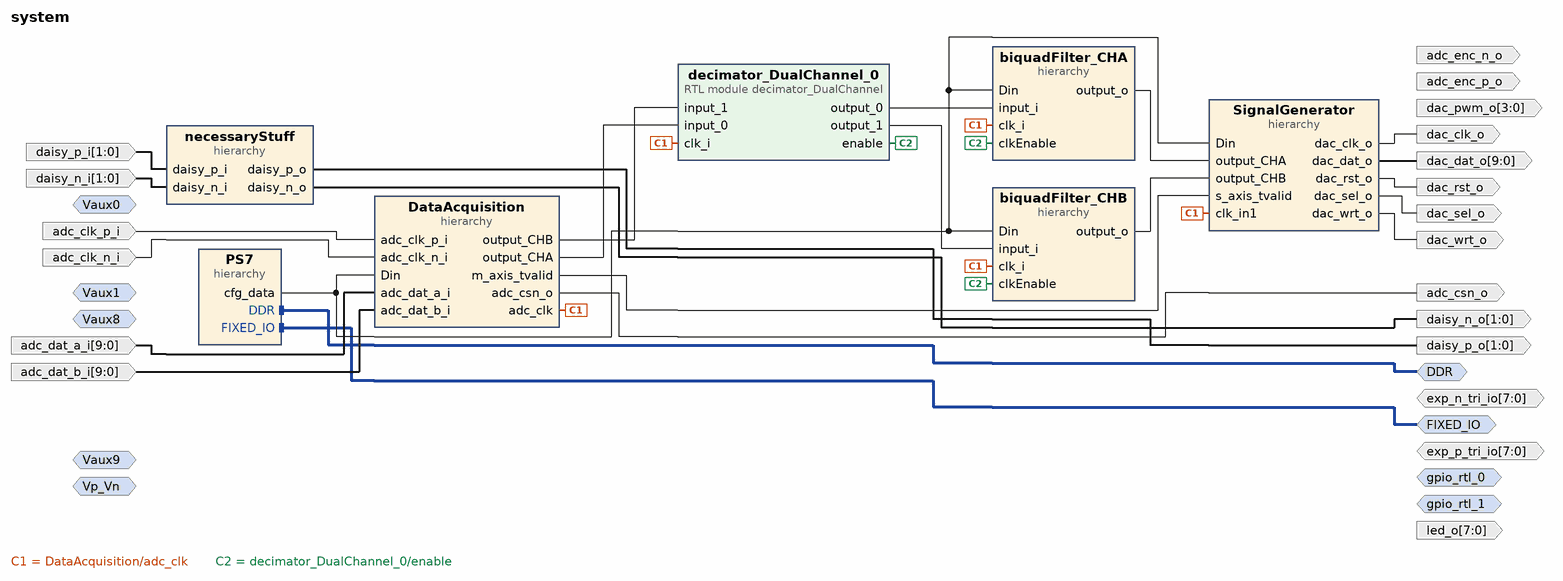
[diagram p0: block diagram of the top level]
# Vivado block design system, xc7z010clg400-1, Vivado 2020.1
create_bd_design system

create_bd_intf_port -mode Slave -vlnv xilinx.com:interface:diff_analog_io_rtl:1.0 Vp_Vn
create_bd_intf_port -mode Slave -vlnv xilinx.com:interface:diff_analog_io_rtl:1.0 Vaux0
create_bd_intf_port -mode Slave -vlnv xilinx.com:interface:diff_analog_io_rtl:1.0 Vaux1
create_bd_intf_port -mode Slave -vlnv xilinx.com:interface:diff_analog_io_rtl:1.0 Vaux9
create_bd_intf_port -mode Slave -vlnv xilinx.com:interface:diff_analog_io_rtl:1.0 Vaux8
create_bd_intf_port -mode Master -vlnv xilinx.com:interface:ddrx_rtl:1.0 DDR
create_bd_intf_port -mode Master -vlnv xilinx.com:display_processing_system7:fixedio_rtl:1.0 FIXED_IO
create_bd_intf_port -mode Master -vlnv xilinx.com:interface:gpio_rtl:1.0 gpio_rtl_0
create_bd_intf_port -mode Master -vlnv xilinx.com:interface:gpio_rtl:1.0 gpio_rtl_1
create_bd_port -dir I -from 9 -to 0 adc_dat_a_i
create_bd_port -dir I -from 9 -to 0 adc_dat_b_i
create_bd_port -dir I adc_clk_p_i
create_bd_port -dir I adc_clk_n_i
create_bd_port -dir O adc_enc_p_o
create_bd_port -dir O adc_enc_n_o
create_bd_port -dir O adc_csn_o
create_bd_port -dir O -from 9 -to 0 dac_dat_o
create_bd_port -dir O dac_clk_o
create_bd_port -dir O dac_rst_o
create_bd_port -dir O dac_sel_o
create_bd_port -dir O dac_wrt_o
create_bd_port -dir O -from 3 -to 0 dac_pwm_o
create_bd_port -dir IO -from 7 -to 0 exp_p_tri_io
create_bd_port -dir IO -from 7 -to 0 exp_n_tri_io
create_bd_port -dir O -from 1 -to 0 daisy_p_o
create_bd_port -dir O -from 1 -to 0 daisy_n_o
create_bd_port -dir I -from 1 -to 0 daisy_p_i
create_bd_port -dir I -from 1 -to 0 daisy_n_i
create_bd_port -dir O -from 7 -to 0 led_o

create_bd_cell -type hier SignalGenerator
create_bd_cell -type hier DataAcquisition
create_bd_cell -type hier PS7
create_bd_cell -type hier biquadFilter_CHA
create_bd_cell -type hier necessaryStuff
create_bd_cell -type module -reference decimator_DualChannel decimator_DualChannel_0
set_property -dict {CONFIG.clock_size 3 CONFIG.input_size 10 CONFIG.output_size 10} [get_bd_cells decimator_DualChannel_0]
create_bd_cell -type hier biquadFilter_CHB

# ---- hierarchy /SignalGenerator ----
current_bd_instance /SignalGenerator
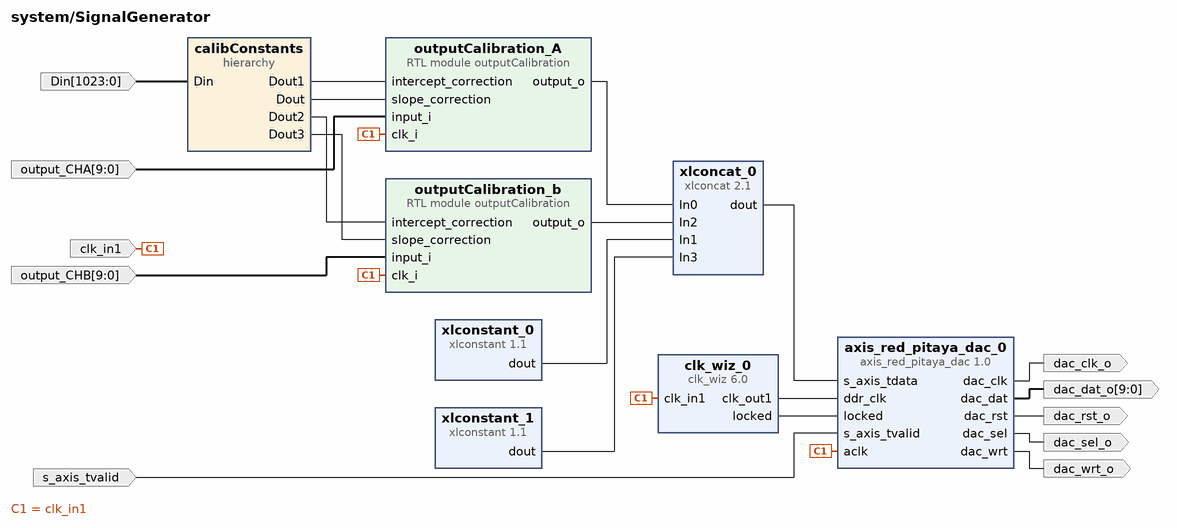
[diagram p1: block diagram inside /SignalGenerator]
create_bd_pin -dir I -type clk clk_in1
create_bd_pin -dir O -type clk dac_clk_o
create_bd_pin -dir O -type rst dac_rst_o
create_bd_pin -dir O dac_sel_o
create_bd_pin -dir O dac_wrt_o
create_bd_pin -dir O -from 9 -to 0 dac_dat_o
create_bd_pin -dir I s_axis_tvalid
create_bd_pin -dir I -from 9 -to 0 output_CHB
create_bd_pin -dir I -from 9 -to 0 output_CHA
create_bd_pin -dir I -from 1023 -to 0 Din

create_bd_cell -type ip -vlnv pavel-demin:user:axis_red_pitaya_dac:1.0 axis_red_pitaya_dac_0
set_property -dict {CONFIG.DAC_DATA_WIDTH 10} [get_bd_cells axis_red_pitaya_dac_0]
create_bd_cell -type ip -vlnv xilinx.com:ip:clk_wiz:6.0 clk_wiz_0
set_property -dict [list \
  CONFIG.CLKIN1_JITTER_PS 80.0 \
  CONFIG.CLKOUT1_JITTER 104.759 \
  CONFIG.CLKOUT1_PHASE_ERROR 96.948 \
  CONFIG.CLKOUT1_REQUESTED_OUT_FREQ 250.000 \
  CONFIG.MMCM_CLKFBOUT_MULT_F 8.000 \
  CONFIG.MMCM_CLKIN1_PERIOD 8.000 \
  CONFIG.MMCM_CLKOUT0_DIVIDE_F 4.000 \
  CONFIG.MMCM_DIVCLK_DIVIDE 1 \
  CONFIG.PRIM_IN_FREQ 125.000 \
  CONFIG.USE_RESET false \
] [get_bd_cells clk_wiz_0]
create_bd_cell -type ip -vlnv xilinx.com:ip:xlconstant:1.1 xlconstant_0
set_property -dict {CONFIG.CONST_VAL 0 CONFIG.CONST_WIDTH 6} [get_bd_cells xlconstant_0]
create_bd_cell -type ip -vlnv xilinx.com:ip:xlconcat:2.1 xlconcat_0
set_property -dict [list \
  CONFIG.IN0_WIDTH 10 \
  CONFIG.IN1_WIDTH 6 \
  CONFIG.IN2_WIDTH 10 \
  CONFIG.IN3_WIDTH 6 \
  CONFIG.NUM_PORTS 4 \
] [get_bd_cells xlconcat_0]
create_bd_cell -type ip -vlnv xilinx.com:ip:xlconstant:1.1 xlconstant_1
set_property -dict {CONFIG.CONST_VAL 0 CONFIG.CONST_WIDTH 6} [get_bd_cells xlconstant_1]
create_bd_cell -type hier calibConstants
create_bd_cell -type module -reference outputCalibration outputCalibration_A
create_bd_cell -type module -reference outputCalibration outputCalibration_b

# ---- hierarchy /SignalGenerator/calibConstants ----
current_bd_instance /SignalGenerator/calibConstants
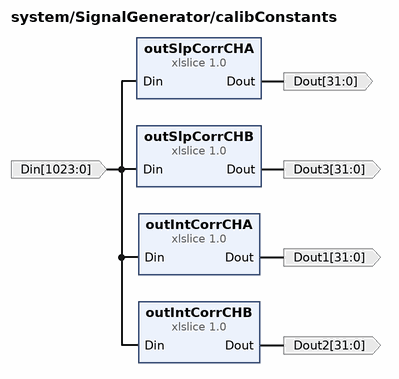
[diagram p2: block diagram inside /SignalGenerator/calibConstants]
create_bd_pin -dir I -from 1023 -to 0 Din
create_bd_pin -dir O -from 31 -to 0 Dout
create_bd_pin -dir O -from 31 -to 0 Dout1
create_bd_pin -dir O -from 31 -to 0 Dout2
create_bd_pin -dir O -from 31 -to 0 Dout3

create_bd_cell -type ip -vlnv xilinx.com:ip:xlslice:1.0 outSlpCorrCHA
set_property -dict {CONFIG.DIN_FROM 543 CONFIG.DIN_TO 512 CONFIG.DIN_WIDTH 1024 CONFIG.DOUT_WIDTH 32} [get_bd_cells outSlpCorrCHA]
create_bd_cell -type ip -vlnv xilinx.com:ip:xlslice:1.0 outIntCorrCHA
set_property -dict {CONFIG.DIN_FROM 511 CONFIG.DIN_TO 480 CONFIG.DIN_WIDTH 1024 CONFIG.DOUT_WIDTH 32} [get_bd_cells outIntCorrCHA]
create_bd_cell -type ip -vlnv xilinx.com:ip:xlslice:1.0 outIntCorrCHB
set_property -dict {CONFIG.DIN_FROM 575 CONFIG.DIN_TO 544 CONFIG.DIN_WIDTH 1024 CONFIG.DOUT_WIDTH 32} [get_bd_cells outIntCorrCHB]
create_bd_cell -type ip -vlnv xilinx.com:ip:xlslice:1.0 outSlpCorrCHB
set_property -dict {CONFIG.DIN_FROM 607 CONFIG.DIN_TO 576 CONFIG.DIN_WIDTH 1024 CONFIG.DOUT_WIDTH 32} [get_bd_cells outSlpCorrCHB]

# ---- hierarchy /DataAcquisition ----
current_bd_instance /DataAcquisition
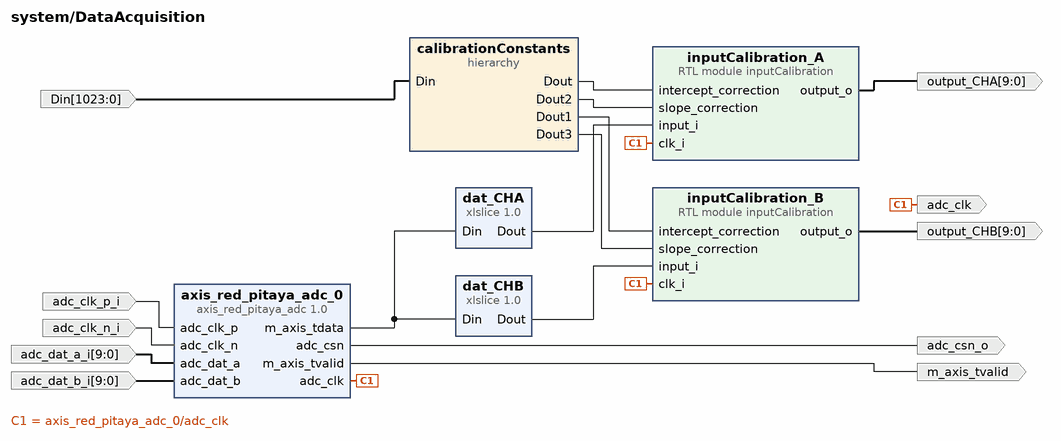
[diagram p3: block diagram inside /DataAcquisition]
create_bd_pin -dir O -type clk adc_clk
create_bd_pin -dir O adc_csn_o
create_bd_pin -dir I adc_clk_p_i
create_bd_pin -dir I adc_clk_n_i
create_bd_pin -dir I -from 9 -to 0 adc_dat_a_i
create_bd_pin -dir I -from 9 -to 0 adc_dat_b_i
create_bd_pin -dir O m_axis_tvalid
create_bd_pin -dir O -from 9 -to 0 output_CHA
create_bd_pin -dir O -from 9 -to 0 output_CHB
create_bd_pin -dir I -from 1023 -to 0 Din

create_bd_cell -type ip -vlnv pavel-demin:user:axis_red_pitaya_adc:1.0 axis_red_pitaya_adc_0
set_property -dict {CONFIG.ADC_DATA_WIDTH 10} [get_bd_cells axis_red_pitaya_adc_0]
create_bd_cell -type ip -vlnv xilinx.com:ip:xlslice:1.0 dat_CHA
set_property -dict {CONFIG.DIN_FROM 9 CONFIG.DOUT_WIDTH 10} [get_bd_cells dat_CHA]
create_bd_cell -type ip -vlnv xilinx.com:ip:xlslice:1.0 dat_CHB
set_property -dict {CONFIG.DIN_FROM 25 CONFIG.DIN_TO 16 CONFIG.DOUT_WIDTH 10} [get_bd_cells dat_CHB]
create_bd_cell -type hier calibrationConstants
create_bd_cell -type module -reference inputCalibration inputCalibration_A
create_bd_cell -type module -reference inputCalibration inputCalibration_B

# ---- hierarchy /DataAcquisition/calibrationConstants ----
current_bd_instance /DataAcquisition/calibrationConstants
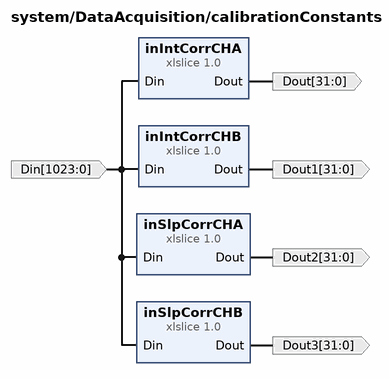
[diagram p4: block diagram inside /DataAcquisition/calibrationConstants]
create_bd_pin -dir I -from 1023 -to 0 Din
create_bd_pin -dir O -from 31 -to 0 Dout
create_bd_pin -dir O -from 31 -to 0 Dout1
create_bd_pin -dir O -from 31 -to 0 Dout2
create_bd_pin -dir O -from 31 -to 0 Dout3

create_bd_cell -type ip -vlnv xilinx.com:ip:xlslice:1.0 inIntCorrCHA
set_property -dict {CONFIG.DIN_FROM 383 CONFIG.DIN_TO 352 CONFIG.DIN_WIDTH 1024 CONFIG.DOUT_WIDTH 32} [get_bd_cells inIntCorrCHA]
create_bd_cell -type ip -vlnv xilinx.com:ip:xlslice:1.0 inIntCorrCHB
set_property -dict {CONFIG.DIN_FROM 447 CONFIG.DIN_TO 416 CONFIG.DIN_WIDTH 1024 CONFIG.DOUT_WIDTH 32} [get_bd_cells inIntCorrCHB]
create_bd_cell -type ip -vlnv xilinx.com:ip:xlslice:1.0 inSlpCorrCHA
set_property -dict {CONFIG.DIN_FROM 415 CONFIG.DIN_TO 384 CONFIG.DIN_WIDTH 1024 CONFIG.DOUT_WIDTH 32} [get_bd_cells inSlpCorrCHA]
create_bd_cell -type ip -vlnv xilinx.com:ip:xlslice:1.0 inSlpCorrCHB
set_property -dict {CONFIG.DIN_FROM 479 CONFIG.DIN_TO 448 CONFIG.DIN_WIDTH 1024 CONFIG.DOUT_WIDTH 32} [get_bd_cells inSlpCorrCHB]

# ---- hierarchy /PS7 ----
current_bd_instance /PS7
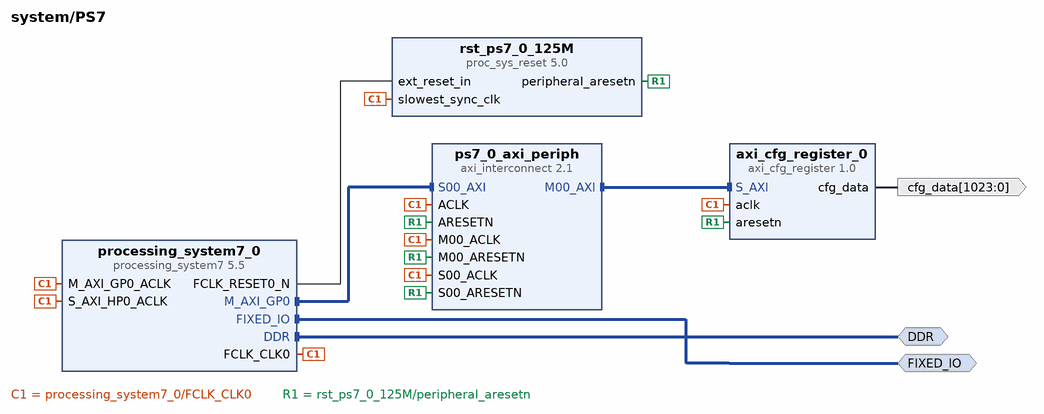
[diagram p5: block diagram inside /PS7]
create_bd_intf_pin -mode Master -vlnv xilinx.com:interface:ddrx_rtl:1.0 DDR
create_bd_intf_pin -mode Master -vlnv xilinx.com:display_processing_system7:fixedio_rtl:1.0 FIXED_IO
create_bd_pin -dir O -from 1023 -to 0 cfg_data

create_bd_cell -type ip -vlnv xilinx.com:ip:processing_system7:5.5 processing_system7_0
set_property -dict [list \
  CONFIG.PCW_APU_PERIPHERAL_FREQMHZ 666.666666 \
  CONFIG.PCW_ENET0_ENET0_IO {MIO 16 .. 27} \
  CONFIG.PCW_ENET0_GRP_MDIO_ENABLE 1 \
  CONFIG.PCW_ENET0_GRP_MDIO_IO EMIO \
  CONFIG.PCW_ENET0_PERIPHERAL_ENABLE 1 \
  CONFIG.PCW_ENET0_RESET_ENABLE 0 \
  CONFIG.PCW_ENET_RESET_ENABLE 1 \
  CONFIG.PCW_ENET_RESET_SELECT {Share reset pin} \
  CONFIG.PCW_FPGA0_PERIPHERAL_FREQMHZ 125 \
  CONFIG.PCW_FPGA1_PERIPHERAL_FREQMHZ 250 \
  CONFIG.PCW_FPGA3_PERIPHERAL_FREQMHZ 200 \
  CONFIG.PCW_GPIO_MIO_GPIO_ENABLE 1 \
  CONFIG.PCW_GPIO_MIO_GPIO_IO MIO \
  CONFIG.PCW_GPIO_PERIPHERAL_ENABLE 1 \
  CONFIG.PCW_I2C0_GRP_INT_ENABLE 0 \
  CONFIG.PCW_I2C0_I2C0_IO {MIO 50 .. 51} \
  CONFIG.PCW_I2C0_PERIPHERAL_ENABLE 1 \
  CONFIG.PCW_I2C_PERIPHERAL_FREQMHZ 111.111115 \
  CONFIG.PCW_I2C_RESET_ENABLE 1 \
  CONFIG.PCW_I2C_RESET_SELECT {Share reset pin} \
  CONFIG.PCW_IMPORT_BOARD_PRESET cfg/red_pitaya.xml \
  CONFIG.PCW_PRESET_BANK1_VOLTAGE {LVCMOS 2.5V} \
  CONFIG.PCW_QSPI_GRP_SINGLE_SS_ENABLE 1 \
  CONFIG.PCW_QSPI_GRP_SINGLE_SS_IO {MIO 1 .. 6} \
  CONFIG.PCW_QSPI_PERIPHERAL_ENABLE 1 \
  CONFIG.PCW_QSPI_PERIPHERAL_FREQMHZ 125 \
  CONFIG.PCW_QSPI_QSPI_IO {MIO 1 .. 6} \
  CONFIG.PCW_SD0_GRP_CD_ENABLE 1 \
  CONFIG.PCW_SD0_GRP_CD_IO {MIO 46} \
  CONFIG.PCW_SD0_GRP_WP_ENABLE 1 \
  CONFIG.PCW_SD0_GRP_WP_IO {MIO 47} \
  CONFIG.PCW_SD0_PERIPHERAL_ENABLE 1 \
  CONFIG.PCW_SD0_SD0_IO {MIO 40 .. 45} \
  CONFIG.PCW_SDIO_PERIPHERAL_FREQMHZ 100 \
  CONFIG.PCW_SINGLE_QSPI_DATA_MODE x4 \
  CONFIG.PCW_SPI0_PERIPHERAL_ENABLE 1 \
  CONFIG.PCW_SPI0_SPI0_IO EMIO \
  CONFIG.PCW_SPI1_PERIPHERAL_ENABLE 1 \
  CONFIG.PCW_SPI1_SPI1_IO {MIO 10 .. 15} \
  CONFIG.PCW_TTC0_PERIPHERAL_ENABLE 1 \
  CONFIG.PCW_TTC0_TTC0_IO EMIO \
  CONFIG.PCW_UART0_PERIPHERAL_ENABLE 1 \
  CONFIG.PCW_UART0_UART0_IO {MIO 14 .. 15} \
  CONFIG.PCW_UART1_PERIPHERAL_ENABLE 1 \
  CONFIG.PCW_UART1_UART1_IO {MIO 8 .. 9} \
  CONFIG.PCW_UART_PERIPHERAL_FREQMHZ 100 \
  CONFIG.PCW_UIPARAM_DDR_BUS_WIDTH {16 Bit} \
  CONFIG.PCW_UIPARAM_DDR_FREQ_MHZ 533.333333 \
  CONFIG.PCW_UIPARAM_DDR_PARTNO {MT41J256M16 RE-125} \
  CONFIG.PCW_USB0_PERIPHERAL_ENABLE 1 \
  CONFIG.PCW_USB0_RESET_ENABLE 1 \
  CONFIG.PCW_USB0_RESET_IO {MIO 48} \
  CONFIG.PCW_USB0_USB0_IO {MIO 28 .. 39} \
  CONFIG.PCW_USB_RESET_ENABLE 1 \
  CONFIG.PCW_USB_RESET_SELECT {Share reset pin} \
  CONFIG.PCW_USE_S_AXI_HP0 1 \
] [get_bd_cells processing_system7_0]
# 429 more settings of processing_system7_0 are not shown: defaults, MIO pin electricals, DDR timing, and values the tool derives
create_bd_cell -type ip -vlnv xilinx.com:ip:proc_sys_reset:5.0 rst_ps7_0_125M
create_bd_cell -type ip -vlnv xilinx.com:ip:axi_interconnect:2.1 ps7_0_axi_periph
set_property -dict {CONFIG.NUM_MI 1} [get_bd_cells ps7_0_axi_periph]
create_bd_cell -type ip -vlnv pavel-demin:user:axi_cfg_register:1.0 axi_cfg_register_0

# ---- hierarchy /biquadFilter_CHA ----
current_bd_instance /biquadFilter_CHA
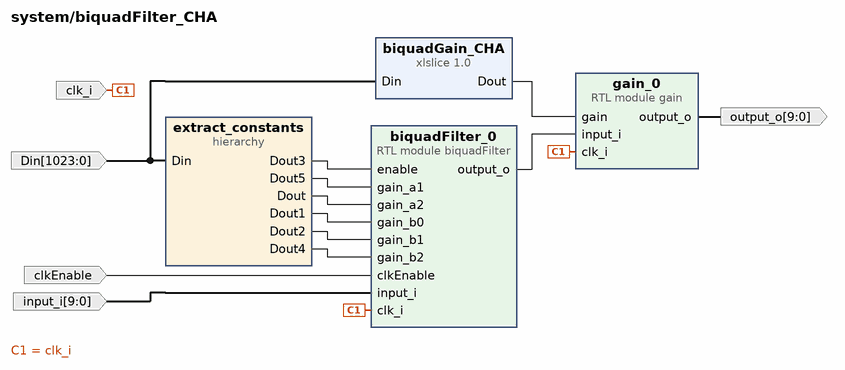
[diagram p6: block diagram inside /biquadFilter_CHA]
create_bd_pin -dir I clk_i
create_bd_pin -dir I clkEnable
create_bd_pin -dir I -from 9 -to 0 input_i
create_bd_pin -dir O -from 9 -to 0 output_o
create_bd_pin -dir I -from 1023 -to 0 Din

create_bd_cell -type hier extract_constants
create_bd_cell -type module -reference biquadFilter biquadFilter_0
set_property -dict [list \
  CONFIG.in_left_radix 1 \
  CONFIG.in_right_radix 9 \
  CONFIG.out_left_radix 1 \
  CONFIG.out_right_radix 9 \
] [get_bd_cells biquadFilter_0]
create_bd_cell -type ip -vlnv xilinx.com:ip:xlslice:1.0 biquadGain_CHA
set_property -dict [list \
  CONFIG.DIN_FROM 639 \
  CONFIG.DIN_TO 608 \
  CONFIG.DIN_WIDTH 1024 \
  CONFIG.DOUT_WIDTH 32 \
] [get_bd_cells biquadGain_CHA]
create_bd_cell -type module -reference gain gain_0
set_property -dict [list \
  CONFIG.in_left_radix 1 \
  CONFIG.in_right_radix 9 \
  CONFIG.out_left_radix 1 \
  CONFIG.out_right_radix 9 \
] [get_bd_cells gain_0]

# ---- hierarchy /biquadFilter_CHA/extract_constants ----
current_bd_instance /biquadFilter_CHA/extract_constants
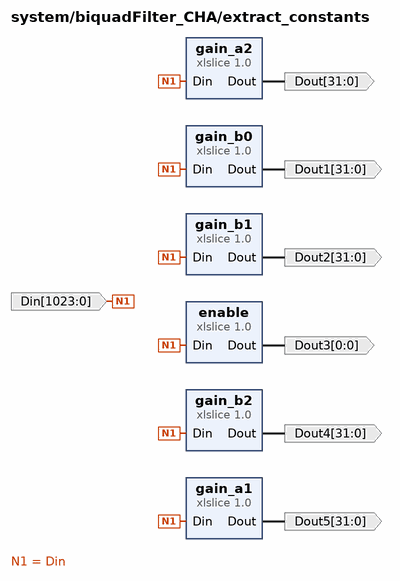
[diagram p7: block diagram inside /biquadFilter_CHA/extract_constants]
create_bd_pin -dir I -from 1023 -to 0 Din
create_bd_pin -dir O -from 31 -to 0 Dout
create_bd_pin -dir O -from 31 -to 0 Dout1
create_bd_pin -dir O -from 31 -to 0 Dout2
create_bd_pin -dir O -from 0 -to 0 Dout3
create_bd_pin -dir O -from 31 -to 0 Dout4
create_bd_pin -dir O -from 31 -to 0 Dout5

create_bd_cell -type ip -vlnv xilinx.com:ip:xlslice:1.0 gain_a2
set_property -dict {CONFIG.DIN_FROM 95 CONFIG.DIN_TO 64 CONFIG.DIN_WIDTH 1024 CONFIG.DOUT_WIDTH 32} [get_bd_cells gain_a2]
create_bd_cell -type ip -vlnv xilinx.com:ip:xlslice:1.0 gain_b0
set_property -dict {CONFIG.DIN_FROM 127 CONFIG.DIN_TO 96 CONFIG.DIN_WIDTH 1024 CONFIG.DOUT_WIDTH 32} [get_bd_cells gain_b0]
create_bd_cell -type ip -vlnv xilinx.com:ip:xlslice:1.0 gain_b1
set_property -dict {CONFIG.DIN_FROM 159 CONFIG.DIN_TO 128 CONFIG.DIN_WIDTH 1024 CONFIG.DOUT_WIDTH 32} [get_bd_cells gain_b1]
create_bd_cell -type ip -vlnv xilinx.com:ip:xlslice:1.0 enable
set_property -dict {CONFIG.DIN_FROM 0 CONFIG.DIN_TO 0 CONFIG.DIN_WIDTH 1024 CONFIG.DOUT_WIDTH 1} [get_bd_cells enable]
create_bd_cell -type ip -vlnv xilinx.com:ip:xlslice:1.0 gain_b2
set_property -dict {CONFIG.DIN_FROM 191 CONFIG.DIN_TO 160 CONFIG.DIN_WIDTH 1024 CONFIG.DOUT_WIDTH 32} [get_bd_cells gain_b2]
create_bd_cell -type ip -vlnv xilinx.com:ip:xlslice:1.0 gain_a1
set_property -dict {CONFIG.DIN_FROM 63 CONFIG.DIN_TO 32 CONFIG.DIN_WIDTH 1024 CONFIG.DOUT_WIDTH 32} [get_bd_cells gain_a1]

# ---- hierarchy /necessaryStuff ----
current_bd_instance /necessaryStuff
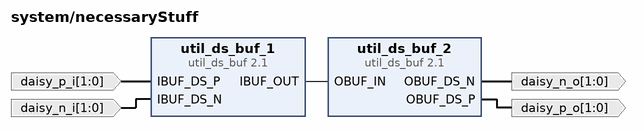
[diagram p8: block diagram inside /necessaryStuff]
create_bd_pin -dir I -from 1 -to 0 daisy_p_i
create_bd_pin -dir I -from 1 -to 0 daisy_n_i
create_bd_pin -dir O -from 1 -to 0 -type clk daisy_p_o
create_bd_pin -dir O -from 1 -to 0 -type clk daisy_n_o

create_bd_cell -type ip -vlnv xilinx.com:ip:util_ds_buf:2.1 util_ds_buf_1
set_property -dict {CONFIG.C_SIZE 2} [get_bd_cells util_ds_buf_1]
create_bd_cell -type ip -vlnv xilinx.com:ip:util_ds_buf:2.1 util_ds_buf_2
set_property -dict {CONFIG.C_BUF_TYPE OBUFDS CONFIG.C_SIZE 2} [get_bd_cells util_ds_buf_2]

# ---- hierarchy /biquadFilter_CHB ----
current_bd_instance /biquadFilter_CHB
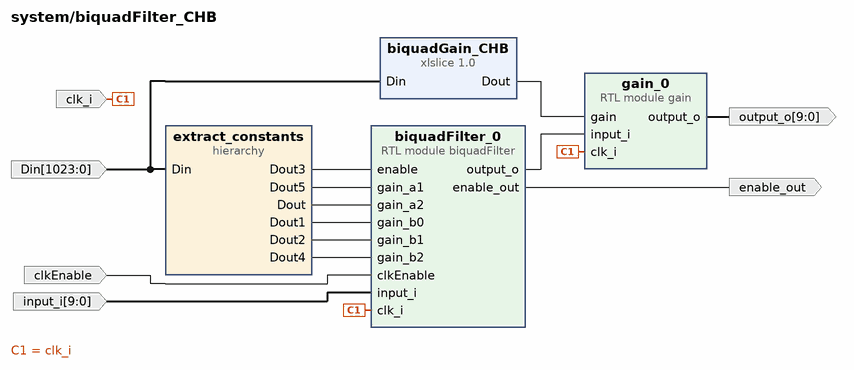
[diagram p9: block diagram inside /biquadFilter_CHB]
create_bd_pin -dir I clk_i
create_bd_pin -dir I clkEnable
create_bd_pin -dir I -from 9 -to 0 input_i
create_bd_pin -dir O enable_out
create_bd_pin -dir O -from 9 -to 0 output_o
create_bd_pin -dir I -from 1023 -to 0 Din

create_bd_cell -type hier extract_constants
create_bd_cell -type module -reference biquadFilter biquadFilter_0
set_property -dict [list \
  CONFIG.in_left_radix 1 \
  CONFIG.in_right_radix 9 \
  CONFIG.out_left_radix 1 \
  CONFIG.out_right_radix 9 \
] [get_bd_cells biquadFilter_0]
create_bd_cell -type ip -vlnv xilinx.com:ip:xlslice:1.0 biquadGain_CHB
set_property -dict [list \
  CONFIG.DIN_FROM 671 \
  CONFIG.DIN_TO 640 \
  CONFIG.DIN_WIDTH 1024 \
  CONFIG.DOUT_WIDTH 32 \
] [get_bd_cells biquadGain_CHB]
create_bd_cell -type module -reference gain gain_0
set_property -dict [list \
  CONFIG.in_left_radix 1 \
  CONFIG.in_right_radix 9 \
  CONFIG.out_left_radix 1 \
  CONFIG.out_right_radix 9 \
] [get_bd_cells gain_0]

# ---- hierarchy /biquadFilter_CHB/extract_constants ----
current_bd_instance /biquadFilter_CHB/extract_constants
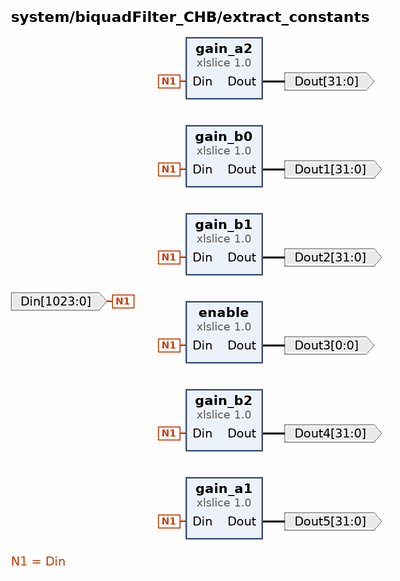
[diagram p10: block diagram inside /biquadFilter_CHB/extract_constants]
create_bd_pin -dir I -from 1023 -to 0 Din
create_bd_pin -dir O -from 31 -to 0 Dout
create_bd_pin -dir O -from 31 -to 0 Dout1
create_bd_pin -dir O -from 31 -to 0 Dout2
create_bd_pin -dir O -from 0 -to 0 Dout3
create_bd_pin -dir O -from 31 -to 0 Dout4
create_bd_pin -dir O -from 31 -to 0 Dout5

create_bd_cell -type ip -vlnv xilinx.com:ip:xlslice:1.0 gain_a2
set_property -dict {CONFIG.DIN_FROM 255 CONFIG.DIN_TO 224 CONFIG.DIN_WIDTH 1024 CONFIG.DOUT_WIDTH 32} [get_bd_cells gain_a2]
create_bd_cell -type ip -vlnv xilinx.com:ip:xlslice:1.0 gain_b0
set_property -dict {CONFIG.DIN_FROM 287 CONFIG.DIN_TO 256 CONFIG.DIN_WIDTH 1024 CONFIG.DOUT_WIDTH 32} [get_bd_cells gain_b0]
create_bd_cell -type ip -vlnv xilinx.com:ip:xlslice:1.0 gain_b1
set_property -dict {CONFIG.DIN_FROM 319 CONFIG.DIN_TO 288 CONFIG.DIN_WIDTH 1024 CONFIG.DOUT_WIDTH 32} [get_bd_cells gain_b1]
create_bd_cell -type ip -vlnv xilinx.com:ip:xlslice:1.0 enable
set_property -dict {CONFIG.DIN_FROM 1 CONFIG.DIN_TO 1 CONFIG.DIN_WIDTH 1024 CONFIG.DOUT_WIDTH 1} [get_bd_cells enable]
create_bd_cell -type ip -vlnv xilinx.com:ip:xlslice:1.0 gain_b2
set_property -dict {CONFIG.DIN_FROM 351 CONFIG.DIN_TO 320 CONFIG.DIN_WIDTH 1024 CONFIG.DOUT_WIDTH 32} [get_bd_cells gain_b2]
create_bd_cell -type ip -vlnv xilinx.com:ip:xlslice:1.0 gain_a1
set_property -dict {CONFIG.DIN_FROM 223 CONFIG.DIN_TO 192 CONFIG.DIN_WIDTH 1024 CONFIG.DOUT_WIDTH 32} [get_bd_cells gain_a1]

# ---- connections ----

current_bd_instance /SignalGenerator
connect_bd_net [get_bd_pins clk_wiz_0/clk_out1] [get_bd_pins axis_red_pitaya_dac_0/ddr_clk]
connect_bd_net [get_bd_pins clk_wiz_0/locked] [get_bd_pins axis_red_pitaya_dac_0/locked]
connect_bd_net -net axis_red_pitaya_adc_0_adc_clk [get_bd_pins clk_in1] \
  [get_bd_pins clk_wiz_0/clk_in1] [get_bd_pins axis_red_pitaya_dac_0/aclk] [get_bd_pins outputCalibration_A/clk_i] \
  [get_bd_pins outputCalibration_b/clk_i]
connect_bd_net [get_bd_pins axis_red_pitaya_dac_0/dac_clk] [get_bd_pins dac_clk_o]
connect_bd_net [get_bd_pins axis_red_pitaya_dac_0/dac_rst] [get_bd_pins dac_rst_o]
connect_bd_net [get_bd_pins axis_red_pitaya_dac_0/dac_sel] [get_bd_pins dac_sel_o]
connect_bd_net [get_bd_pins axis_red_pitaya_dac_0/dac_wrt] [get_bd_pins dac_wrt_o]
connect_bd_net [get_bd_pins axis_red_pitaya_dac_0/dac_dat] [get_bd_pins dac_dat_o]
connect_bd_net [get_bd_pins xlconstant_0/dout] [get_bd_pins xlconcat_0/In1]
connect_bd_net [get_bd_pins xlconcat_0/dout] [get_bd_pins axis_red_pitaya_dac_0/s_axis_tdata]
connect_bd_net [get_bd_pins s_axis_tvalid] [get_bd_pins axis_red_pitaya_dac_0/s_axis_tvalid]
connect_bd_net [get_bd_pins xlconstant_1/dout] [get_bd_pins xlconcat_0/In3]
connect_bd_net -net input_i_1 [get_bd_pins output_CHA] [get_bd_pins outputCalibration_A/input_i]
connect_bd_net [get_bd_pins outputCalibration_A/output_o] [get_bd_pins xlconcat_0/In0]
connect_bd_net [get_bd_pins outputCalibration_b/output_o] [get_bd_pins xlconcat_0/In2]
connect_bd_net [get_bd_pins output_CHB] [get_bd_pins outputCalibration_b/input_i]
connect_bd_net -net outIntCorrCHA_Dout [get_bd_pins calibConstants/Dout1] [get_bd_pins outputCalibration_A/intercept_correction]
connect_bd_net -net outSlpCorrCHA_Dout [get_bd_pins calibConstants/Dout] [get_bd_pins outputCalibration_A/slope_correction]
connect_bd_net -net outIntCorrCHB_Dout [get_bd_pins calibConstants/Dout2] [get_bd_pins outputCalibration_b/intercept_correction]
connect_bd_net -net outSlpCorrCHB_Dout [get_bd_pins calibConstants/Dout3] [get_bd_pins outputCalibration_b/slope_correction]
connect_bd_net [get_bd_pins Din] [get_bd_pins calibConstants/Din]

current_bd_instance /SignalGenerator/calibConstants
connect_bd_net [get_bd_pins Din] \
  [get_bd_pins outSlpCorrCHB/Din] [get_bd_pins outIntCorrCHB/Din] [get_bd_pins outIntCorrCHA/Din] \
  [get_bd_pins outSlpCorrCHA/Din]
connect_bd_net [get_bd_pins outSlpCorrCHA/Dout] [get_bd_pins Dout]
connect_bd_net [get_bd_pins outIntCorrCHA/Dout] [get_bd_pins Dout1]
connect_bd_net [get_bd_pins outIntCorrCHB/Dout] [get_bd_pins Dout2]
connect_bd_net [get_bd_pins outSlpCorrCHB/Dout] [get_bd_pins Dout3]

current_bd_instance /DataAcquisition
connect_bd_net [get_bd_pins axis_red_pitaya_adc_0/adc_clk] \
  [get_bd_pins adc_clk] [get_bd_pins inputCalibration_A/clk_i] [get_bd_pins inputCalibration_B/clk_i]
connect_bd_net [get_bd_pins axis_red_pitaya_adc_0/adc_csn] [get_bd_pins adc_csn_o]
connect_bd_net [get_bd_pins adc_clk_p_i] [get_bd_pins axis_red_pitaya_adc_0/adc_clk_p]
connect_bd_net [get_bd_pins adc_clk_n_i] [get_bd_pins axis_red_pitaya_adc_0/adc_clk_n]
connect_bd_net [get_bd_pins adc_dat_a_i] [get_bd_pins axis_red_pitaya_adc_0/adc_dat_a]
connect_bd_net [get_bd_pins adc_dat_b_i] [get_bd_pins axis_red_pitaya_adc_0/adc_dat_b]
connect_bd_net [get_bd_pins axis_red_pitaya_adc_0/m_axis_tvalid] [get_bd_pins m_axis_tvalid]
connect_bd_net [get_bd_pins axis_red_pitaya_adc_0/m_axis_tdata] [get_bd_pins dat_CHA/Din] [get_bd_pins dat_CHB/Din]
connect_bd_net [get_bd_pins inputCalibration_A/output_o] [get_bd_pins output_CHA]
connect_bd_net [get_bd_pins dat_CHA/Dout] [get_bd_pins inputCalibration_A/input_i]
connect_bd_net [get_bd_pins dat_CHB/Dout] [get_bd_pins inputCalibration_B/input_i]
connect_bd_net [get_bd_pins inputCalibration_B/output_o] [get_bd_pins output_CHB]
connect_bd_net -net intCorrCHA_Dout [get_bd_pins calibrationConstants/Dout] [get_bd_pins inputCalibration_A/intercept_correction]
connect_bd_net -net inSlpCorrCHA_Dout [get_bd_pins calibrationConstants/Dout2] [get_bd_pins inputCalibration_A/slope_correction]
connect_bd_net -net inIntCorrCHB_Dout [get_bd_pins calibrationConstants/Dout1] [get_bd_pins inputCalibration_B/intercept_correction]
connect_bd_net -net inSlpCorrCHB_Dout [get_bd_pins calibrationConstants/Dout3] [get_bd_pins inputCalibration_B/slope_correction]
connect_bd_net [get_bd_pins Din] [get_bd_pins calibrationConstants/Din]

current_bd_instance /DataAcquisition/calibrationConstants
connect_bd_net [get_bd_pins Din] \
  [get_bd_pins inSlpCorrCHB/Din] [get_bd_pins inIntCorrCHB/Din] [get_bd_pins inSlpCorrCHA/Din] [get_bd_pins inIntCorrCHA/Din]
connect_bd_net -net intCorrCHA_Dout [get_bd_pins inIntCorrCHA/Dout] [get_bd_pins Dout]
connect_bd_net [get_bd_pins inIntCorrCHB/Dout] [get_bd_pins Dout1]
connect_bd_net [get_bd_pins inSlpCorrCHA/Dout] [get_bd_pins Dout2]
connect_bd_net [get_bd_pins inSlpCorrCHB/Dout] [get_bd_pins Dout3]

current_bd_instance /PS7
connect_bd_intf_net [get_bd_intf_pins FIXED_IO] [get_bd_intf_pins processing_system7_0/FIXED_IO]
connect_bd_intf_net [get_bd_intf_pins processing_system7_0/M_AXI_GP0] [get_bd_intf_pins ps7_0_axi_periph/S00_AXI]
connect_bd_intf_net [get_bd_intf_pins ps7_0_axi_periph/M00_AXI] [get_bd_intf_pins axi_cfg_register_0/S_AXI]
connect_bd_intf_net [get_bd_intf_pins DDR] [get_bd_intf_pins processing_system7_0/DDR]
connect_bd_net [get_bd_pins processing_system7_0/FCLK_RESET0_N] [get_bd_pins rst_ps7_0_125M/ext_reset_in]
connect_bd_net [get_bd_pins processing_system7_0/FCLK_CLK0] \
  [get_bd_pins processing_system7_0/S_AXI_HP0_ACLK] [get_bd_pins ps7_0_axi_periph/S00_ACLK] \
  [get_bd_pins rst_ps7_0_125M/slowest_sync_clk] [get_bd_pins ps7_0_axi_periph/M00_ACLK] [get_bd_pins ps7_0_axi_periph/ACLK] \
  [get_bd_pins processing_system7_0/M_AXI_GP0_ACLK] [get_bd_pins axi_cfg_register_0/aclk]
connect_bd_net [get_bd_pins rst_ps7_0_125M/peripheral_aresetn] \
  [get_bd_pins ps7_0_axi_periph/S00_ARESETN] [get_bd_pins ps7_0_axi_periph/M00_ARESETN] \
  [get_bd_pins ps7_0_axi_periph/ARESETN] [get_bd_pins axi_cfg_register_0/aresetn]
connect_bd_net [get_bd_pins axi_cfg_register_0/cfg_data] [get_bd_pins cfg_data]

current_bd_instance /biquadFilter_CHA
connect_bd_net -net enable_Dout [get_bd_pins extract_constants/Dout3] [get_bd_pins biquadFilter_0/enable]
connect_bd_net -net gain_a1_Dout [get_bd_pins extract_constants/Dout5] [get_bd_pins biquadFilter_0/gain_a1]
connect_bd_net -net gain_a2_Dout [get_bd_pins extract_constants/Dout] [get_bd_pins biquadFilter_0/gain_a2]
connect_bd_net -net gain_b0_Dout [get_bd_pins extract_constants/Dout1] [get_bd_pins biquadFilter_0/gain_b0]
connect_bd_net -net gain_b1_Dout [get_bd_pins extract_constants/Dout2] [get_bd_pins biquadFilter_0/gain_b1]
connect_bd_net -net gain_b2_Dout [get_bd_pins extract_constants/Dout4] [get_bd_pins biquadFilter_0/gain_b2]
connect_bd_net -net axis_red_pitaya_adc_0_adc_clk [get_bd_pins clk_i] [get_bd_pins biquadFilter_0/clk_i] [get_bd_pins gain_0/clk_i]
connect_bd_net -net decimator_0_enable [get_bd_pins clkEnable] [get_bd_pins biquadFilter_0/clkEnable]
connect_bd_net -net decimator_0_output_o [get_bd_pins input_i] [get_bd_pins biquadFilter_0/input_i]
connect_bd_net -net axi_cfg_register_0_cfg_data [get_bd_pins Din] [get_bd_pins extract_constants/Din] [get_bd_pins biquadGain_CHA/Din]
connect_bd_net [get_bd_pins biquadFilter_0/output_o] [get_bd_pins gain_0/input_i]
connect_bd_net [get_bd_pins gain_0/output_o] [get_bd_pins output_o]
connect_bd_net [get_bd_pins biquadGain_CHA/Dout] [get_bd_pins gain_0/gain]

current_bd_instance /biquadFilter_CHA/extract_constants
connect_bd_net -net axi_cfg_register_0_cfg_data [get_bd_pins Din] \
  [get_bd_pins gain_a1/Din] [get_bd_pins gain_b0/Din] [get_bd_pins gain_b1/Din] [get_bd_pins gain_b2/Din] \
  [get_bd_pins enable/Din] [get_bd_pins gain_a2/Din]
connect_bd_net [get_bd_pins gain_a2/Dout] [get_bd_pins Dout]
connect_bd_net [get_bd_pins gain_b0/Dout] [get_bd_pins Dout1]
connect_bd_net [get_bd_pins gain_b1/Dout] [get_bd_pins Dout2]
connect_bd_net [get_bd_pins enable/Dout] [get_bd_pins Dout3]
connect_bd_net [get_bd_pins gain_b2/Dout] [get_bd_pins Dout4]
connect_bd_net [get_bd_pins gain_a1/Dout] [get_bd_pins Dout5]

current_bd_instance /necessaryStuff
connect_bd_net [get_bd_pins util_ds_buf_1/IBUF_OUT] [get_bd_pins util_ds_buf_2/OBUF_IN]
connect_bd_net [get_bd_pins daisy_p_i] [get_bd_pins util_ds_buf_1/IBUF_DS_P]
connect_bd_net [get_bd_pins daisy_n_i] [get_bd_pins util_ds_buf_1/IBUF_DS_N]
connect_bd_net [get_bd_pins util_ds_buf_2/OBUF_DS_P] [get_bd_pins daisy_p_o]
connect_bd_net [get_bd_pins util_ds_buf_2/OBUF_DS_N] [get_bd_pins daisy_n_o]

current_bd_instance /biquadFilter_CHB
connect_bd_net -net enable_Dout [get_bd_pins extract_constants/Dout3] [get_bd_pins biquadFilter_0/enable]
connect_bd_net -net gain_a1_Dout [get_bd_pins extract_constants/Dout5] [get_bd_pins biquadFilter_0/gain_a1]
connect_bd_net -net gain_a2_Dout [get_bd_pins extract_constants/Dout] [get_bd_pins biquadFilter_0/gain_a2]
connect_bd_net -net gain_b0_Dout [get_bd_pins extract_constants/Dout1] [get_bd_pins biquadFilter_0/gain_b0]
connect_bd_net -net gain_b1_Dout [get_bd_pins extract_constants/Dout2] [get_bd_pins biquadFilter_0/gain_b1]
connect_bd_net -net gain_b2_Dout [get_bd_pins extract_constants/Dout4] [get_bd_pins biquadFilter_0/gain_b2]
connect_bd_net -net axis_red_pitaya_adc_0_adc_clk [get_bd_pins clk_i] [get_bd_pins biquadFilter_0/clk_i] [get_bd_pins gain_0/clk_i]
connect_bd_net -net decimator_0_enable [get_bd_pins clkEnable] [get_bd_pins biquadFilter_0/clkEnable]
connect_bd_net -net decimator_0_output_o [get_bd_pins input_i] [get_bd_pins biquadFilter_0/input_i]
connect_bd_net [get_bd_pins biquadFilter_0/enable_out] [get_bd_pins enable_out]
connect_bd_net -net axi_cfg_register_0_cfg_data [get_bd_pins Din] [get_bd_pins extract_constants/Din] [get_bd_pins biquadGain_CHB/Din]
connect_bd_net [get_bd_pins gain_0/output_o] [get_bd_pins output_o]
connect_bd_net [get_bd_pins biquadGain_CHB/Dout] [get_bd_pins gain_0/gain]
connect_bd_net [get_bd_pins biquadFilter_0/output_o] [get_bd_pins gain_0/input_i]

current_bd_instance /biquadFilter_CHB/extract_constants
connect_bd_net -net axi_cfg_register_0_cfg_data [get_bd_pins Din] \
  [get_bd_pins gain_a1/Din] [get_bd_pins gain_b0/Din] [get_bd_pins gain_b1/Din] [get_bd_pins gain_b2/Din] \
  [get_bd_pins enable/Din] [get_bd_pins gain_a2/Din]
connect_bd_net [get_bd_pins gain_a2/Dout] [get_bd_pins Dout]
connect_bd_net [get_bd_pins gain_b0/Dout] [get_bd_pins Dout1]
connect_bd_net [get_bd_pins gain_b1/Dout] [get_bd_pins Dout2]
connect_bd_net [get_bd_pins enable/Dout] [get_bd_pins Dout3]
connect_bd_net [get_bd_pins gain_b2/Dout] [get_bd_pins Dout4]
connect_bd_net [get_bd_pins gain_a1/Dout] [get_bd_pins Dout5]

current_bd_instance /
connect_bd_intf_net -intf_net processing_system7_0_DDR [get_bd_intf_ports DDR] [get_bd_intf_pins PS7/DDR]
connect_bd_intf_net -intf_net processing_system7_0_FIXED_IO [get_bd_intf_ports FIXED_IO] [get_bd_intf_pins PS7/FIXED_IO]
connect_bd_net [get_bd_ports daisy_p_i] [get_bd_pins necessaryStuff/daisy_p_i]
connect_bd_net [get_bd_ports daisy_n_i] [get_bd_pins necessaryStuff/daisy_n_i]
connect_bd_net -net util_ds_buf_2_OBUF_DS_P [get_bd_pins necessaryStuff/daisy_p_o] [get_bd_ports daisy_p_o]
connect_bd_net -net util_ds_buf_2_OBUF_DS_N [get_bd_pins necessaryStuff/daisy_n_o] [get_bd_ports daisy_n_o]
connect_bd_net [get_bd_ports adc_clk_p_i] [get_bd_pins DataAcquisition/adc_clk_p_i]
connect_bd_net [get_bd_ports adc_clk_n_i] [get_bd_pins DataAcquisition/adc_clk_n_i]
connect_bd_net [get_bd_ports adc_dat_a_i] [get_bd_pins DataAcquisition/adc_dat_a_i]
connect_bd_net [get_bd_ports adc_dat_b_i] [get_bd_pins DataAcquisition/adc_dat_b_i]
connect_bd_net -net axis_red_pitaya_adc_0_adc_csn [get_bd_pins DataAcquisition/adc_csn_o] [get_bd_ports adc_csn_o]
connect_bd_net -net axis_red_pitaya_dac_0_dac_clk [get_bd_pins SignalGenerator/dac_clk_o] [get_bd_ports dac_clk_o]
connect_bd_net -net axis_red_pitaya_dac_0_dac_rst [get_bd_pins SignalGenerator/dac_rst_o] [get_bd_ports dac_rst_o]
connect_bd_net -net axis_red_pitaya_dac_0_dac_sel [get_bd_pins SignalGenerator/dac_sel_o] [get_bd_ports dac_sel_o]
connect_bd_net -net axis_red_pitaya_dac_0_dac_wrt [get_bd_pins SignalGenerator/dac_wrt_o] [get_bd_ports dac_wrt_o]
connect_bd_net -net axis_red_pitaya_dac_0_dac_dat [get_bd_pins SignalGenerator/dac_dat_o] [get_bd_ports dac_dat_o]
connect_bd_net -net s_axis_tvalid_1 [get_bd_pins DataAcquisition/m_axis_tvalid] [get_bd_pins SignalGenerator/s_axis_tvalid]
connect_bd_net -net axi_cfg_register_0_cfg_data [get_bd_pins PS7/cfg_data] \
  [get_bd_pins biquadFilter_CHA/Din] [get_bd_pins biquadFilter_CHB/Din] [get_bd_pins DataAcquisition/Din] \
  [get_bd_pins SignalGenerator/Din]
connect_bd_net [get_bd_pins DataAcquisition/adc_clk] \
  [get_bd_pins SignalGenerator/clk_in1] [get_bd_pins biquadFilter_CHA/clk_i] [get_bd_pins decimator_DualChannel_0/clk_i] \
  [get_bd_pins biquadFilter_CHB/clk_i]
connect_bd_net [get_bd_pins DataAcquisition/output_CHB] [get_bd_pins decimator_DualChannel_0/input_1]
connect_bd_net [get_bd_pins decimator_DualChannel_0/enable] [get_bd_pins biquadFilter_CHA/clkEnable] [get_bd_pins biquadFilter_CHB/clkEnable]
connect_bd_net [get_bd_pins decimator_DualChannel_0/output_0] [get_bd_pins biquadFilter_CHA/input_i]
connect_bd_net [get_bd_pins decimator_DualChannel_0/output_1] [get_bd_pins biquadFilter_CHB/input_i]
connect_bd_net [get_bd_pins DataAcquisition/output_CHA] [get_bd_pins decimator_DualChannel_0/input_0]
connect_bd_net [get_bd_pins biquadFilter_CHB/output_o] [get_bd_pins SignalGenerator/output_CHB]
connect_bd_net [get_bd_pins biquadFilter_CHA/output_o] [get_bd_pins SignalGenerator/output_CHA]

# ---- address map ----
assign_bd_address -offset 0x40000000 -range 2K -target_address_space [get_bd_addr_spaces PS7/processing_system7_0/Data] [get_bd_addr_segs PS7/axi_cfg_register_0/s_axi/reg0]

validate_bd_design
save_bd_design
